# Altium schematic sheet AD9854.SchDoc
size A3
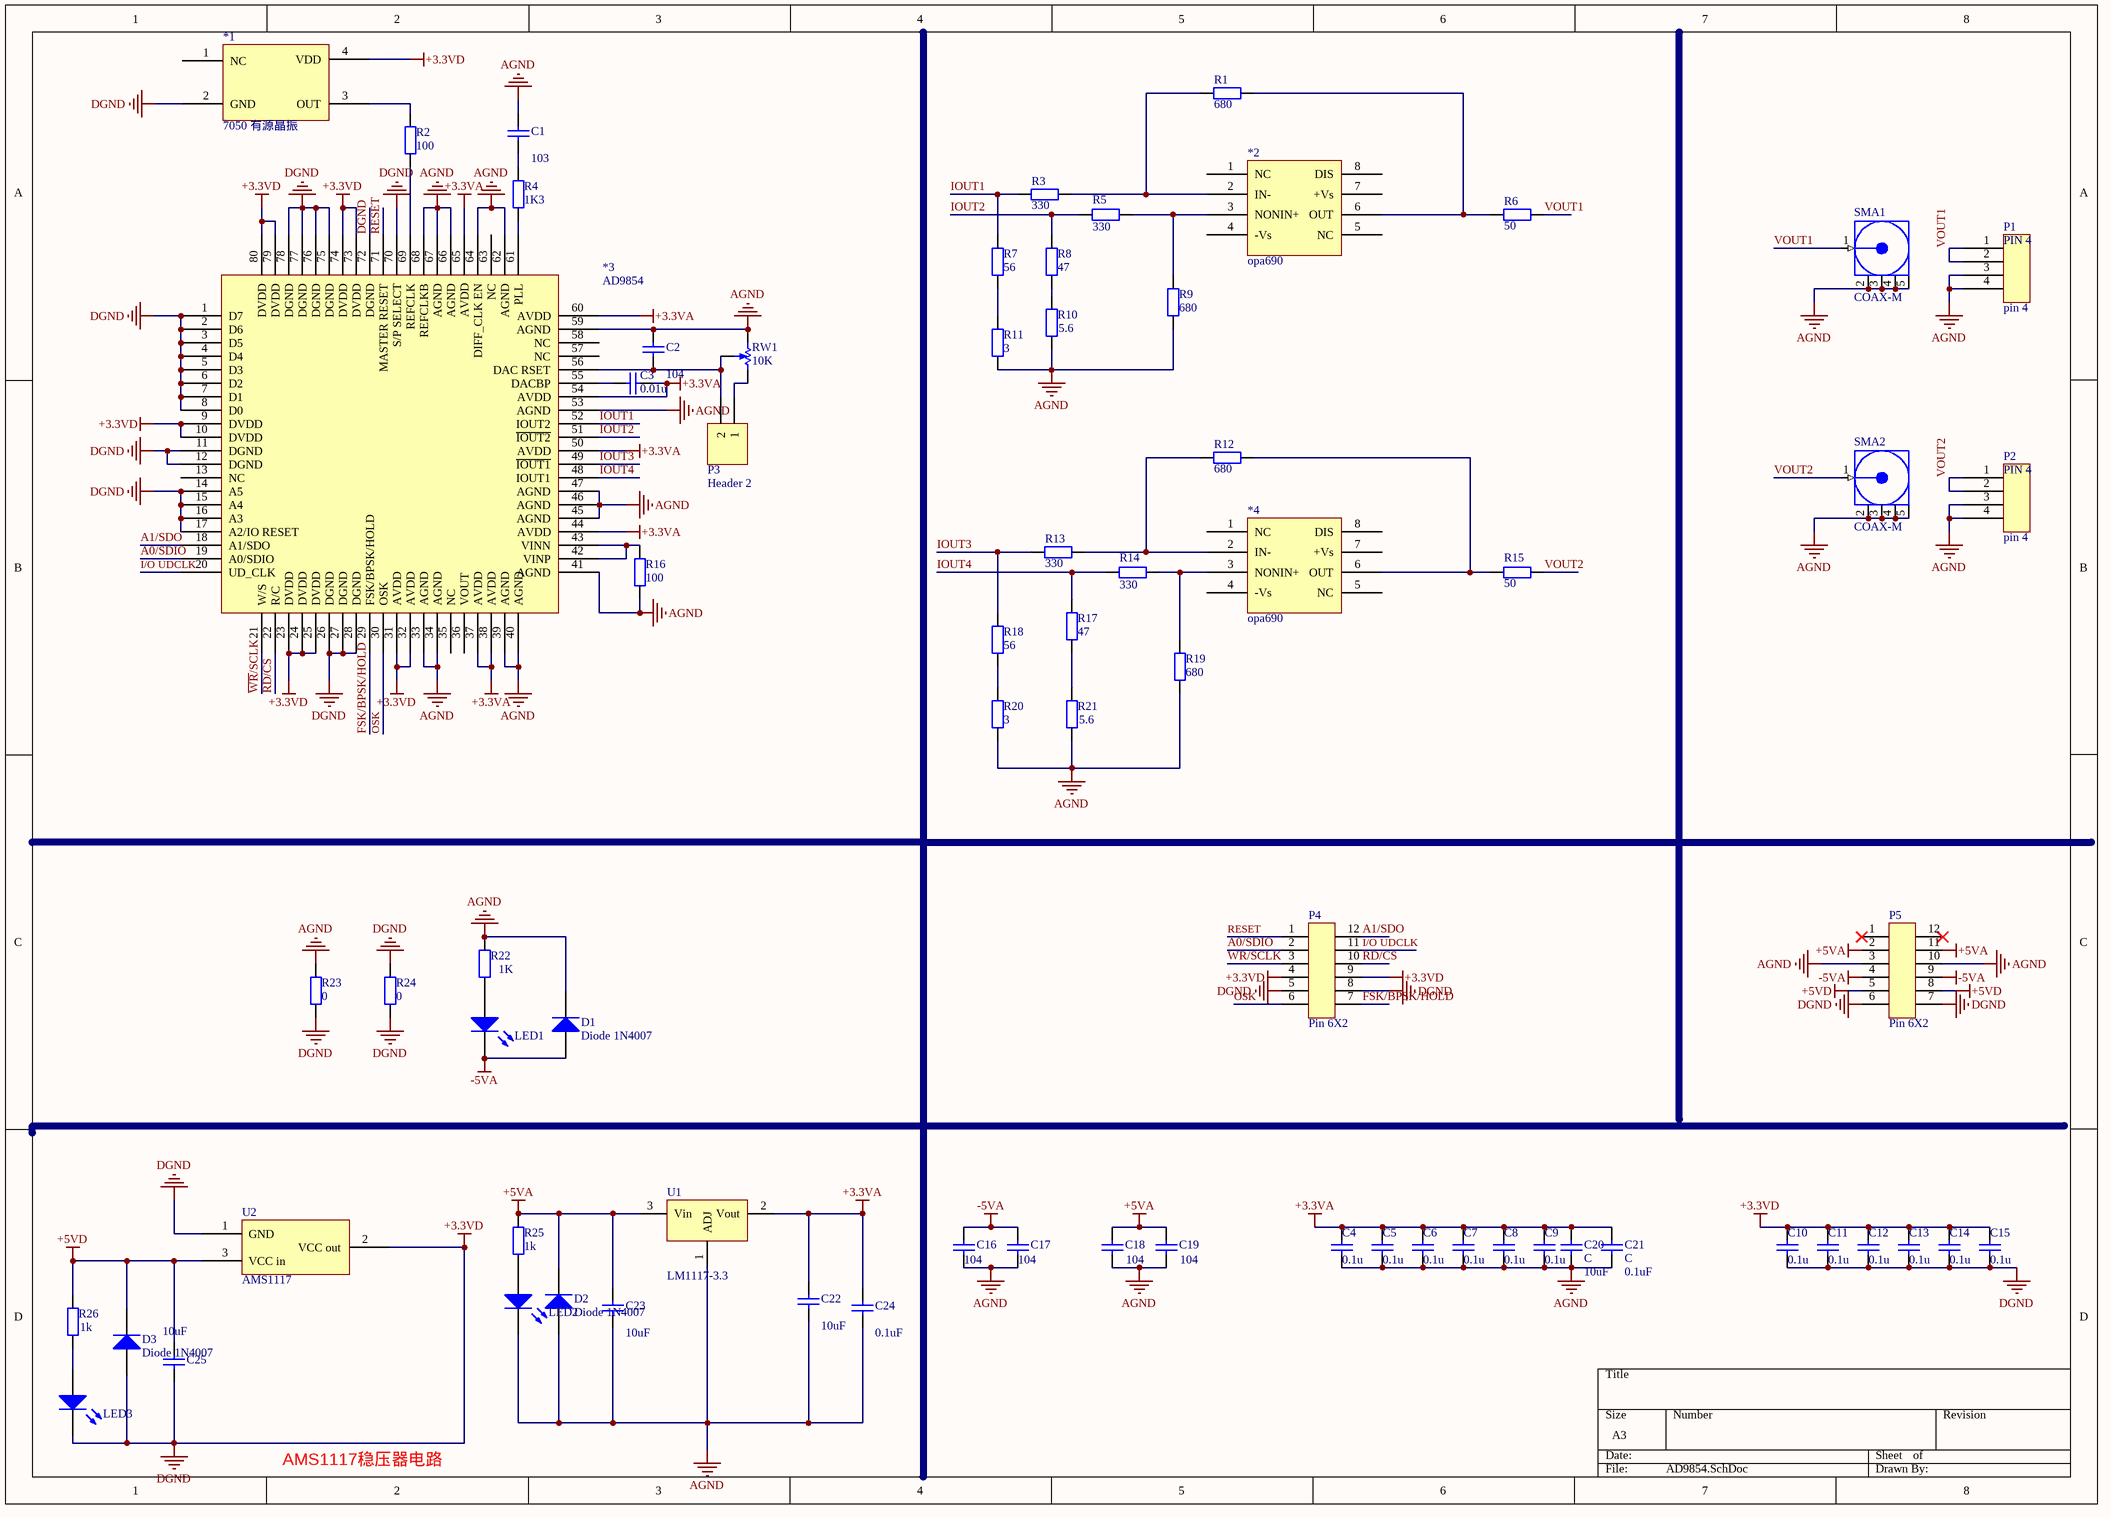
[diagram p0: AD9854.SchDoc]

## Parts
*1  7050 有源晶振  [7050晶振]
*2  opa690  [OPA690]
*3  AD9854  [LPQF 80 9854]
*4  opa690  [OPA690]
C1  value 103  [C0603]  (hidden comment: C)
C2  value 104  [C0603]  (hidden comment: C)
C3  0.01u  [C0603]
C4  0.1u  [C0603]
C5  0.1u  [C0603]
C6  0.1u  [C0603]
C7  0.1u  [C0603]
C8  0.1u  [C0603]
C9  0.1u  [C0603]
C10  0.1u  [C0603]
C11  0.1u  [C0603]
C12  0.1u  [C0603]
C13  0.1u  [C0603]
C14  0.1u  [C0603]
C15  0.1u  [C0603]
C16  value 104  [C0603]  (hidden comment: C)
C17  value 104  [C0603]  (hidden comment: C)
C18  value 104  [C0603]  (hidden comment: C)
C19  value 104  [C0603]  (hidden comment: C)
C20  C  value 10uF  [C0603]
C21  C  value 0.1uF  [C0603]
C22  value 10uF  [C0603]  (hidden comment: C)
C23  value 10uF  [C0603]  (hidden comment: C)
C24  value 0.1uF  [C0603]  (hidden comment: C)
C25  value 10uF  [C0603]  (hidden comment: C)
D1  Diode 1N4007  [二极管SMB]
D2  Diode 1N4007  [二极管SMB]
D3  Diode 1N4007  [二极管SMB]
LED1  LED  [C0603]  (value not drawn)
LED2  LED  [C0603]  (value not drawn)
LED3  LED  [C0603]  (value not drawn)
P1  pin 4  [pin 4]
P2  pin 4  [pin 4]
P3  Header 2  [HDR1X2]
P4  Pin 6X2  [Pin 6X2]
P5  Pin 6X2  [Pin 6X2]
R1  value 680  [C0603]  (hidden comment: R)
R2  value 100  [C0603]  (hidden comment: R)
R3  value 330  [C0603]  (hidden comment: R)
R4  1K3  [C0603]
R5  value 330  [C0603]  (hidden comment: R)
R6  value 50  [C0603]  (hidden comment: R)
R7  value 56  [C0603]  (hidden comment: R)
R8  value 47  [C0603]  (hidden comment: R)
R9  value 680  [C0603]  (hidden comment: R)
R10  value 5.6  [C0603]  (hidden comment: R)
R11  value 3  [C0603]  (hidden comment: R)
R12  value 680  [C0603]  (hidden comment: R)
R13  value 330  [C0603]  (hidden comment: R)
R14  value 330  [C0603]  (hidden comment: R)
R15  value 50  [C0603]  (hidden comment: R)
R16  value 100  [C0603]  (hidden comment: R)
R17  value 47  [C0603]  (hidden comment: R)
R18  value 56  [C0603]  (hidden comment: R)
R19  value 680  [C0603]  (hidden comment: R)
R20  value 3  [C0603]  (hidden comment: R)
R21  value 5.6  [C0603]  (hidden comment: R)
R22  value 1K  [C0603]  (hidden comment: R)
R23  0  [C0603]
R24  0  [C0603]
R25  value 1k  [C0603]  (hidden comment: R)
R26  value 1k  [C0603]  (hidden comment: R)
RW1  value 10K  [电位器]  (hidden comment: R)
SMA1  COAX-M  [SMB_V-RJ45]
SMA2  COAX-M  [SMB_V-RJ45]
U1  LM1117-3.3  [LM78**]
U2  AMS1117  [AMS1117]

## Nets
+3.3VA: *3.37(AVDD) *3.38(AVDD) *3.44(AVDD) *3.50(AVDD) *3.54(AVDD) *3.60(AVDD) *3.65(AVDD) C3.1 C4.2 C5.2 C6.2 C7.2 C8.2 C9.2 C20.2 C21.2 C22.2 C24.2 U1.2(Vout)
+5VA: C18.2 C19.2 C23.2 D2.2(K) P5.2 P5.11 R25.2 U1.3(Vin)
+5VD: C25.1 D3.2(K) P5.5 P5.8 R26.2 U2.3(VCC_in)
-5VA: C16.2 C17.2 D1.1(A) LED1.2(K) P5.4 P5.9
AGND: *3.33(AGND) *3.34(AGND) *3.39(AGND) *3.40(AGND) *3.41(AGND) *3.45(AGND) *3.46(AGND) *3.47(AGND) *3.53(AGND) *3.59(AGND) *3.62(AGND) *3.64(DIFF_CLK_EN) *3.66(AGND) *3.67(AGND) *3.68(REFCLKB) C1.2 C2.2 C4.1 C5.1 C6.1 C7.1 C8.1 C9.1 C16.1 C17.1 C18.1 C19.1 C20.1 C21.1 C22.1 C23.1 C24.1 D1.2(K) D2.1(A) LED2.2(K) P1.3 P1.4 P2.3 P2.4 P5.3 P5.10 R9.1 R10.1 R11.1 R16.2 R19.1 R20.1 R21.1 R22.2 R23.2 RW1.3(-) SMA1.2(GND) SMA1.3(GND) SMA1.4(GND) SMA1.5(GND) SMA2.2(GND) SMA2.3(GND) SMA2.4(GND) SMA2.5(GND) U1.1(ADJ)
DGND: *1.2(GND) *1.4(VDD) *3.1(D7) *3.2(D6) *3.3(D5) *3.4(D4) *3.5(D3) *3.6(D2) *3.7(D1) *3.8(D0) *3.9(DVDD) *3.10(DVDD) *3.11(DGND) *3.12(DGND) *3.14(A5) *3.15(A4) *3.16(A3) *3.17(A2/IO_RESET) *3.23(DVDD) *3.24(DVDD) *3.25(DVDD) *3.26(DGND) *3.27(DGND) *3.28(DGND) *3.31(AVDD) *3.32(AVDD) *3.70(S/P_SELECT) *3.72(DGND) *3.73(DVDD) *3.74(DVDD) *3.75(DGND) *3.76(DGND) *3.77(DGND) *3.78(DGND) *3.79(DVDD) *3.80(DVDD) C10.1 C10.2 C11.1 C11.2 C12.1 C12.2 C13.1 C13.2 C14.1 C14.2 C15.1 C15.2 C25.2 D3.1(A) LED3.2(K) P4.4 P4.5 P4.8 P4.9 P5.6 P5.7 R23.1 R24.1 R24.2 U2.1(GND) U2.2(VCC_out)  [also labelled +3.3VD]
A0/SDIO: *3.19(A0/SDIO) P4.2
A1/SDO: *3.18(A1/SDO) P4.12
FSK/BPSK/HOLD: *3.29(FSK/BPSK/HOLD) P4.7
I/O UDCLK: *3.20(UD_CLK) P4.11
IOUT1: *3.52(IOUT2) R3.1 R7.2
IOUT2: *3.51(~{IOUT2}) R5.1 R8.2
IOUT3: *3.49(~{IOUT1}) R13.1 R18.2
IOUT4: *3.48(IOUT1) R14.1 R17.2
OSK: *3.30(OSK) P4.6
~{RD}/~{CS}: *3.22(R/C) P4.10
RESET: *3.71(MASTER_RESET) P4.1
VOUT1: P1.1 P1.2 R6.2 SMA1.1(Signal)
VOUT2: P2.1 P2.2 R15.2 SMA2.1(Signal)
~{WR}/SCLK: *3.21(W/S) P4.3
Net*1_3: *1.3(OUT) R2.2
Net*2_2: *2.2(IN-) R1.1 R3.2
Net*2_3: *2.3(NONIN+) R5.2 R9.2
Net*2_6: *2.6(OUT) R1.2 R6.1
Net*3_42: *3.42(VINP) *3.43(VINN) R16.1
Net*3_55: *3.55(DACBP) C3.2
Net*3_56: *3.56(DAC_RSET) C2.1 P3.2 RW1.2(W)
Net*3_61: *3.61(PLL) R4.1
Net*3_69: *3.69(REFCLK) R2.1
Net*4_2: *4.2(IN-) R12.1 R13.2
Net*4_3: *4.3(NONIN+) R14.2 R19.2
Net*4_6: *4.6(OUT) R12.2 R15.1
NetC1_1: C1.1 R4.2
NetLED1_1: LED1.1(A) R22.1
NetLED2_1: LED2.1(A) R25.1
NetLED3_1: LED3.1(A) R26.1
NetP3_1: P3.1 RW1.1(+)
NetR7_1: R7.1 R11.2
NetR8_1: R8.1 R10.2
NetR17_1: R17.1 R21.2
NetR18_1: R18.1 R20.2

Not connected (* = marked no-connect by the designer): *1 1(NC); *2 1(NC) 4(-Vs) 5(NC) 7(+Vs) 8(DIS); *3 13(NC) 35(NC) 36(VOUT) 57(NC) 58(NC) 63(NC); *4 1(NC) 4(-Vs) 5(NC) 7(+Vs) 8(DIS); P5 1* 12*

## Notes on the sheet
- AMS1117稳压器电路
- (in symbol pin 4) PIN 4

## Library data of the parts
C3-C15 = C_0805
D1-D3 = Diode 1N4007: 1 Amp General Purpose Rectifier; Published: 8-Jun-2000; LatestRevisionDate: 17-Jul-2002; LatestRevisionNote: Re-released for DXP Platform.; DatasheetVersion: 1998; PackageVersion: Aug-1999; PackageReference: DO-41; Publisher: Altium Limited; PackageDescription: Diode, Axial; Body 5.2 x 2.7 mm (LxDia. max), Lead Dia. 0.86 mm (max); Code_JEDEC: DO-204-AL; ComponentLink1Description: Manufacturer Link; ComponentLink1URL: http://www.fairchildsemi.com/; ComponentLink2Description: Datasheet; ComponentLink2URL: http://www.fairchildsemi.com/ds/1N%2F1N4001.pdf
P3 = Header 2: Header, 2-Pin; LatestRevisionDate: 17-Jul-2002; LatestRevisionNote: Re-released for DXP Platform.; Publisher: Altium Limited
R4 R23 R24 = R_0805
RW1 = 电位器
SMA1 SMA2 = COAX-M: RF Coaxial PCB Connector, MMCX; Thru-Hole, Vertical Mount Plug,  50 Ohm Impedance; PackageDocument: Rev. A, 16-Jun-1997; PCB_Layout: Complies with manufacturer's recommendation.; DrillSize: Corresponds to nominal value.; Published: 15-Jul-2004; LatestRevisionDate: 15-Jul-2004; LatestRevisionNote: Component Replaced.; DatasheetDocument: 30-May-2003; PackageReference: 908-21103; Publisher: Altium Limited; ComponentLink1Description: Manufacturer Link; ComponentLink1URL: http://www.amphenolrf.com/
U1 = LM317